# Altium project PCB_Middle.PrjPcb
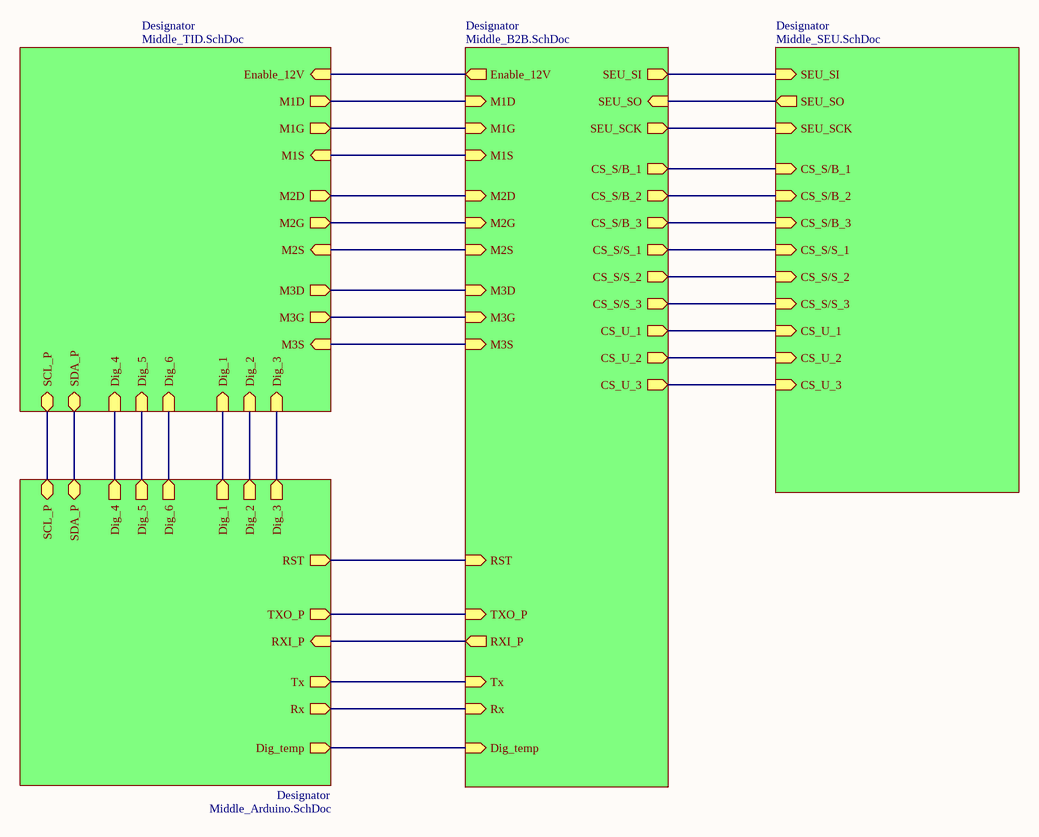
[diagram p0: Middle_Main.SchDoc]
5 sheets, 96 parts. Net scope: hierarchical (ports join the sheet entries above them; power ports are global).
Board file: Middle_PCB_PC104_Shield_Positioning.PcbDoc
Sheets:
  Middle_Main.SchDoc
    Designator = Middle_TID.SchDoc
      Designator = Middle_TID_B.SchDoc
    Designator = Middle_Arduino.SchDoc
    Designator = Middle_B2B.SchDoc

## Sheet Middle_Main.SchDoc
size A4

### Sub-sheets
Designator = Middle_TID.SchDoc: M1D (out), M1G (out), M1S (in), M2D (out), M2G (out), M2S (in), M3D (out), M3G (out), M3S (in), Dig_1 (in), Dig_2 (in), Dig_3 (in), SCL_P (bidir), SDA_P (bidir), Enable_12V (in), Dig_4 (in), Dig_5 (in), Dig_6 (in)
Designator = Middle_SEU.SchDoc (file not in this document): SEU_SI (in), SEU_SO (out), SEU_SCK (in), CS_S/B_2 (in), CS_S/B_3 (in), CS_S/S_1 (in), CS_S/S_2 (in), CS_S/S_3 (in), CS_U_1 (in), CS_U_2 (in), CS_S/B_1 (in), CS_U_3 (in)
Designator = Middle_Arduino.SchDoc: SCL_P (bidir), SDA_P (bidir), Dig_1 (out), Dig_2 (out), Dig_3 (out), TXO_P (out), RXI_P (in), Dig_5 (out), Dig_6 (out), Dig_4 (out), RST (out), Tx (out), Rx (out), Dig_temp (out)
Designator = Middle_B2B.SchDoc: M1D (in), M1G (in), M1S (in), M2D (in), M2G (in), M2S (in), M3D (in), M3G (in), M3S (in), SEU_SI (out), SEU_SO (in), SEU_SCK (out), CS_S/B_2 (out), CS_S/B_3 (out), CS_S/S_1 (out), CS_S/S_2 (out), CS_S/S_3 (out), CS_U_1 (out), CS_U_2 (out), CS_S/B_1 (out), CS_U_3 (out), TXO_P (in), RXI_P (out), Enable_12V (out), RST (in), Tx (in), Rx (in), Dig_temp (in)

### Nets
Dig_1: sheet Designator/Dig_1, sheet Designator/Dig_1
Dig_2: sheet Designator/Dig_2, sheet Designator/Dig_2
Dig_3: sheet Designator/Dig_3, sheet Designator/Dig_3
Dig_4: sheet Designator/Dig_4, sheet Designator/Dig_4
Dig_5: sheet Designator/Dig_5, sheet Designator/Dig_5
Dig_6: sheet Designator/Dig_6, sheet Designator/Dig_6
Dig_temp: sheet Designator/Dig_temp, sheet Designator/Dig_temp
M1D: sheet Designator/M1D, sheet Designator/M1D
M1G: sheet Designator/M1G, sheet Designator/M1G
M1S: sheet Designator/M1S, sheet Designator/M1S
M2D: sheet Designator/M2D, sheet Designator/M2D
M2G: sheet Designator/M2G, sheet Designator/M2G
M2S: sheet Designator/M2S, sheet Designator/M2S
M3D: sheet Designator/M3D, sheet Designator/M3D
M3G: sheet Designator/M3G, sheet Designator/M3G
M3S: sheet Designator/M3S, sheet Designator/M3S
PWR_CTRL_SS_12V: sheet Designator/Enable_12V, sheet Designator/Enable_12V
RST: sheet Designator/RST, sheet Designator/RST
Rx: sheet Designator/Rx, sheet Designator/Rx
SCL (AP): sheet Designator/SCL_P, sheet Designator/SCL_P
SDA (AP): sheet Designator/SDA_P, sheet Designator/SDA_P
SS_EXP1_CLK: sheet Designator/SEU_SCK, sheet Designator/SEU_SCK
SS_EXP1_CS_S/B_0: sheet Designator/CS_S/B_3, sheet Designator/CS_S/B_3
SS_EXP1_CS_S/B_1: sheet Designator/CS_S/B_1, sheet Designator/CS_S/B_1
SS_EXP1_CS_S/B_2: sheet Designator/CS_S/B_2, sheet Designator/CS_S/B_2
SS_EXP1_CS_S/S_0: sheet Designator/CS_S/S_3, sheet Designator/CS_S/S_3
SS_EXP1_CS_S/S_1: sheet Designator/CS_S/S_2, sheet Designator/CS_S/S_2
SS_EXP1_CS_S/S_2: sheet Designator/CS_S/S_1, sheet Designator/CS_S/S_1
SS_EXP1_CS_U_0: sheet Designator/CS_U_3, sheet Designator/CS_U_3
SS_EXP1_CS_U_1: sheet Designator/CS_U_1, sheet Designator/CS_U_1
SS_EXP1_CS_U_2: sheet Designator/CS_U_2, sheet Designator/CS_U_2
SS_EXP1_MISO: sheet Designator/SEU_SO, sheet Designator/SEU_SO
SS_EXP1_MOSI: sheet Designator/SEU_SI, sheet Designator/SEU_SI
SS_EXP2_RXI_P: sheet Designator/RXI_P, sheet Designator/RXI_P
SS_EXP2_TXO_P: sheet Designator/TXO_P, sheet Designator/TXO_P
Tx: sheet Designator/Tx, sheet Designator/Tx

## Sheet Middle_TID.SchDoc
size A4
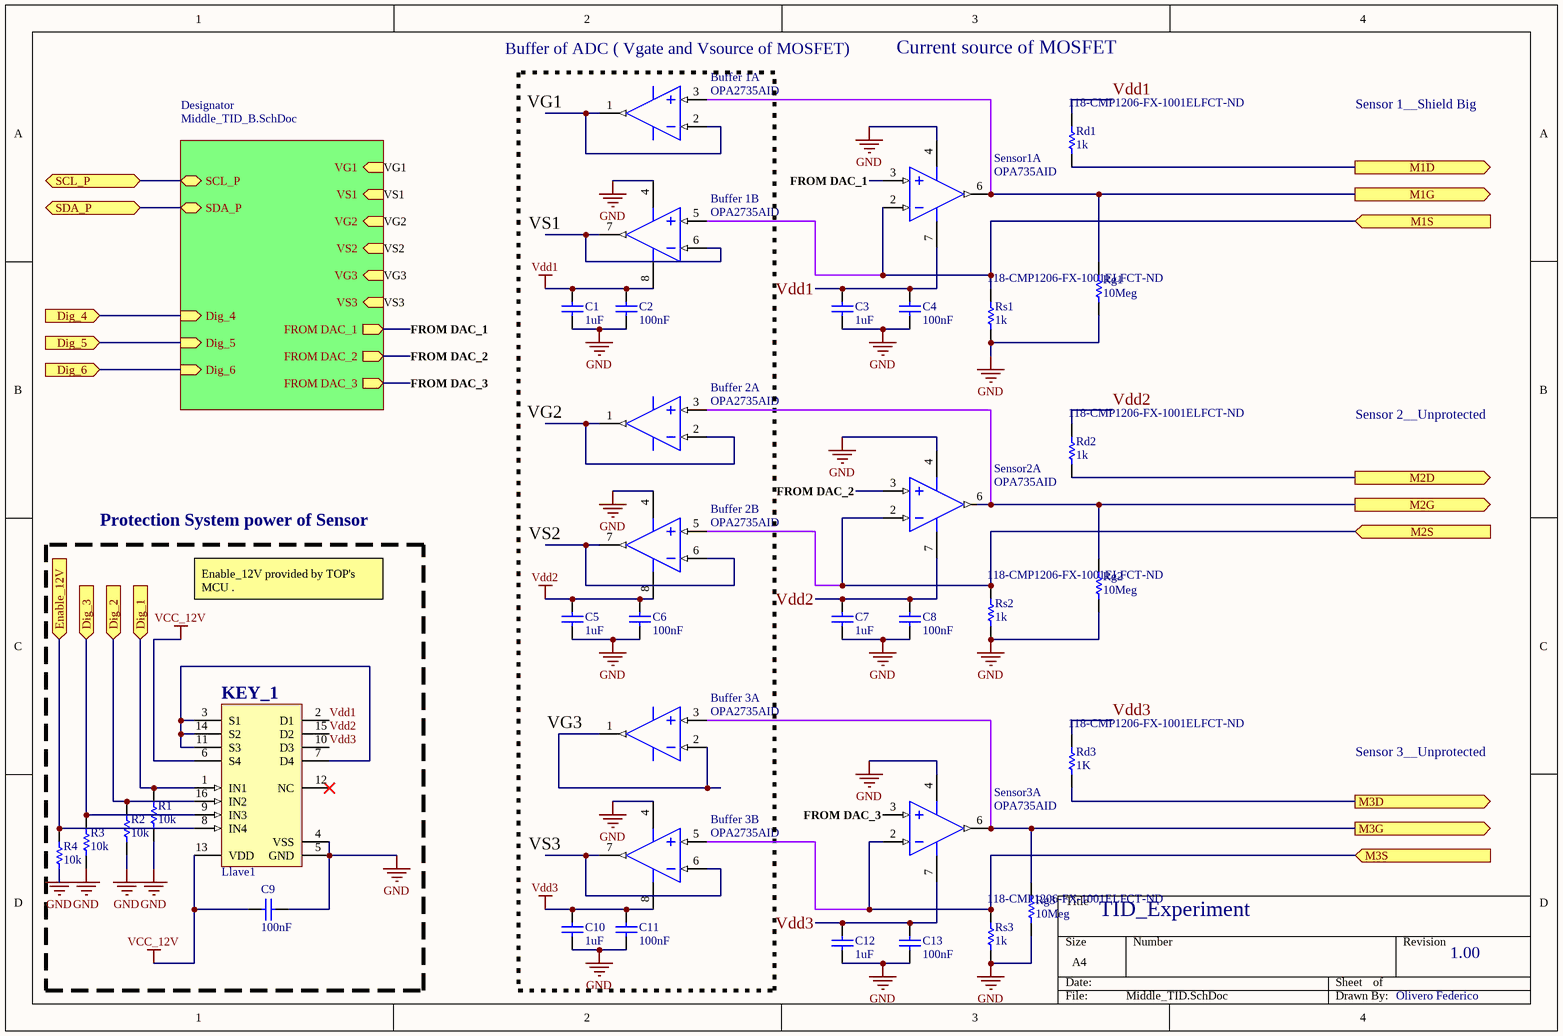
[diagram p1: Middle_TID.SchDoc]

### Parts
Buffer_1  OPA2735AID  [TI-D8_N]  (parts A,B of 2)
Buffer_2  OPA2735AID  [TI-D8_N]  (parts A,B of 2)
Buffer_3  OPA2735AID  [TI-D8_N]  (parts A,B of 2)
C1  1uF  [C1206]
C2  100nF  [C1206]
C3  1uF  [C1206]
C4  100nF  [C1206]
C5  1uF  [C1206]
C6  100nF  [C1206]
C7  1uF  [C1206]
C8  100nF  [C1206]
C9  100nF  [C1206]
C10  1uF  [C1206]
C11  100nF  [C1206]
C12  1uF  [C1206]
C13  100nF  [C1206]
KEY_1  Llave1  [ADI-RU-16_N]
R1  10k  [R1206]
R2  10k  [R1206]
R3  10k  [R1206]
R4  10k  [R1206]
Rd1  1k  Supplier Part Number 1: 118-CMP1206-FX-1001ELFCT-ND  [R1206]
Rd2  1k  Supplier Part Number 1: 118-CMP1206-FX-1001ELFCT-ND  [R1206]
Rd3  1K  Supplier Part Number 1: 118-CMP1206-FX-1001ELFCT-ND  [R1206]
Rg1  10Meg  [R1206]
Rg2  10Meg  [R1206]
Rg3  10Meg  [R1206]
Rs1  1k  Supplier Part Number 1: 118-CMP1206-FX-1001ELFCT-ND  [R1206]
Rs2  1k  Supplier Part Number 1: 118-CMP1206-FX-1001ELFCT-ND  [R1206]
Rs3  1k  Supplier Part Number 2: 118-CMP1206-FX-1001ELFCT-ND  [R1206]
Sensor1  OPA735AID  [TI-D8_N]  (part A of 2)
Sensor2  OPA735AID  [TI-D8_N]  (part A of 2)
Sensor3  OPA735AID  [TI-D8_N]  (part A of 2)

### Blocks framed on the sheet
Protection System power of Sensor: C9 KEY_1 R1-R4

### Sub-sheets
Designator = Middle_TID_B.SchDoc: VG1 (in), VS1 (in), VG2 (in), VS2 (in), VG3 (in), VS3 (in), SCL_P (bidir), SDA_P (bidir), FROM DAC_1 (out), Dig_4 (in), Dig_5 (in), Dig_6 (in), FROM DAC_2 (out), FROM DAC_3 (out)

### Ports
Dig_1 (in), Dig_2 (in), Dig_3 (in), Dig_4 (in), Dig_5 (in), Dig_6 (in), Enable_12V (in), M1D (out), M1G (out), M1S (in), M2D (out), M2G (out), M2S (in), M3D (out), M3G (out), M3S (in), SCL_P (bidir), SDA_P (bidir)

### Nets
GND: Buffer_1.4(V-) Buffer_2.4(V-) Buffer_3.4(V-) C1.1 C2.1 C3.1 C4.1 C5.1 C6.1 C7.1 C8.1 C9.1 C10.1 C11.1 C12.1 C13.1 KEY_1.4(VSS) KEY_1.5(GND) R1.1 R2.1 R3.1 R4.1 Rg1.1 Rg2.1 Rg3.1 Rs1.1 Rs2.1 Rs3.1 Sensor1.4(V-) Sensor2.4(V-) Sensor3.4(V-)
VCC_12V: C9.2 KEY_1.6(S4) KEY_1.13(VDD)
Vdd1: Buffer_1.8(V+) C1.2 C2.2 C3.2 C4.2 KEY_1.2(D1) Rd1.2 Sensor1.7(V+)
Vdd2: Buffer_2.8(V+) C5.2 C6.2 C7.2 C8.2 KEY_1.15(D2) Rd2.2 Sensor2.7(V+)
Vdd3: Buffer_3.8(V+) C10.2 C11.2 C12.2 C13.2 KEY_1.10(D3) Rd3.2 Sensor3.7(V+)
Dig_1: KEY_1.1(IN1) R1.2 ; port Dig_1
Dig_2: KEY_1.16(IN2) R2.2 ; port Dig_2
Dig_3: KEY_1.9(IN3) R3.2 ; port Dig_3
Dig_4: port Dig_4, sheet Designator/Dig_4
Dig_5: port Dig_5, sheet Designator/Dig_5
Dig_6: port Dig_6, sheet Designator/Dig_6
FROM DAC_1: Sensor1.3(IN+) ; sheet Designator/FROM DAC_1
FROM DAC_2: Sensor2.3(IN+) ; sheet Designator/FROM DAC_2
FROM DAC_3: Sensor3.3(IN+) ; sheet Designator/FROM DAC_3
M1D: Rd1.1 ; port M1D
M1G: Buffer_1.3(IN_A+) Rg1.2 Sensor1.6(OUT) ; port M1G
M1S: Buffer_1.5(IN_B+) Rs1.2 Sensor1.2(IN-) ; port M1S
M2D: Rd2.1 ; port M2D
M2G: Buffer_2.3(IN_A+) Rg2.2 Sensor2.6(OUT) ; port M2G
M2S: Buffer_2.5(IN_B+) Rs2.2 Sensor2.2(IN-) ; port M2S
M3D: Rd3.1 ; port M3D
M3G: Buffer_3.3(IN_A+) Rg3.2 Sensor3.6(OUT) ; port M3G
M3S: Buffer_3.5(IN_B+) Rs3.2 Sensor3.2(IN-) ; port M3S
PWR_CTRL_SS_12V: KEY_1.8(IN4) R4.2 ; port Enable_12V
SCL (AP): port SCL_P, sheet Designator/SCL_P
SDA (AP): port SDA_P, sheet Designator/SDA_P
VG1: Buffer_1.1(OUT_A) Buffer_1.2(IN_A-) ; sheet Designator/VG1
VG2: Buffer_2.1(OUT_A) Buffer_2.2(IN_A-) ; sheet Designator/VG2
VG3: Buffer_3.1(OUT_A) Buffer_3.2(IN_A-) ; sheet Designator/VG3
VS1: Buffer_1.6(IN_B-) Buffer_1.7(OUT_B) ; sheet Designator/VS1
VS2: Buffer_2.6(IN_B-) Buffer_2.7(OUT_B) ; sheet Designator/VS2
VS3: Buffer_3.6(IN_B-) Buffer_3.7(OUT_B) ; sheet Designator/VS3
NetKEY_1_3: KEY_1.3(S1) KEY_1.7(D4) KEY_1.11(S3) KEY_1.14(S2)

Not connected (* = marked no-connect by the designer): KEY_1 12(NC)*

### Notes on the sheet
- (near Buffer_1) Buffer of ADC ( Vgate and Vsource of MOSFET)
- Current source of MOSFET
- Sensor 1__Shield Big
- Sensor 2__Unprotected
- Enable_12V provided by TOP's MCU .
- Sensor 3__Unprotected
- TID_Experiment
- 1.00
- Olivero Federico

### Library data of the parts
Buffer_1-Buffer_3 = OPA2735AID: 0.05 uV/degC (max) Single-Supply CMOS Operational Amplifier, Zero-Drift Series, 2.7 to 12 V, -40 to 85 degC, 8-pin SOIC (D8), Green (RoHS & no Sb/Br); Manufacturer: Texas Instruments; CMRR(Min)(dB): 115; GBW(Typ)(MHz): 1.6; IIB(Max)(pA): 200; Iq per channel(Max)(mA): 0.75; Number of Channels: 2; Offset Drift(Typ)(uV/C): 0.01; Packing: TUBE; Rating: Catalog; Slew Rate(Typ)(V/us): 1.5; Sub Family: Low Offset Voltage Amplifier (<=500uV), Low Supply Voltage Amplifier (<=2.7V), Precision Amplifier, Zero Drift Precision Amplifier; Total Supply Voltage(Max)(+5V is 5, +/-5V is 10): 12; Total Supply Voltage(Min)(+5V is 5, +/-5V is 10): 2.7; Vio (25C)(Max)(mV): 0.005; DatasheetVersion: SBOS282B; PackageVersion: 4040047-3/M, 06/2011; PackageReference: D8; PackageDescription: 8-Pin Plastic Small Outline, Body 4.9 x 3.9 mm, Pitch 1.27 mm; Supplier 1: Digi-Key; Supplier Part Number 1: 296-16770-5-ND; Supplier 2: Newark; Supplier Part Number 2: 01J0602; Supplier 3: Mouser; Supplier Part Number 3: 595-OPA2735AID; Eco-Plan: Green (RoHS & no Sb/Br); Mounting Technology: Surface Mount; Code_JEDEC: MS-012; PartNumber: OPA2735AID; ComponentLink1Description: Manufacturer URL; ComponentLink1URL: http://www.ti.com/; ComponentLink2Description: Datasheet; ComponentLink2URL: http://www.ti.com/lit/ds/symlink/opa2735.pdf; ComponentLink3Description: Package Specification; ComponentLink3URL: http://www.ti.com/litv/pdf/msoi002j
C1-C13 = C1206: 1206 Capacitor
  C1 C3 C5 C7 C10: Supplier 1: Digi-Key; Supplier Part Number 1: 399-1255-1-ND
  C2 C4 C6 C8 C9 C11 C13: Supplier 1: Digi-Key; Supplier Part Number 1: 478-1556-1-ND
KEY_1 = ADG5412BRUZ: High Voltage Latch-Up Proof, Quad SPST Switches, -40 to 125 degC, 16-pin SOP (RU-16), Tube; Manufacturer: Analog Devices; Id, Is (ON): 100pA, 100pA, 100pA, 100pA; Is OFF: 50pA, 50pA, 50pA, 50pA; Power Dissipation: 1mW; Ron (ohms): 9; DatasheetVersion: Rev. A; PackageVersion: Nov-02; PackageReference: RU-16; PackageDescription: 16-Pin Thin Shrink Small Outline Package, Body 5 x 4.4 mm, Pitch 0.65 mm; Supplier 1: Digi-Key; Supplier Part Number 1: ADG5412BRUZ-ND; Supplier 2: Farnell; Supplier Part Number 2: 2081057; Supplier 3: Newark; Supplier Part Number 3: 85R6320; Supplier 4: Mouser; Supplier Part Number 4: 584-ADG5412BRUZ; Configuration: SPST; Packing: Tube; Mounting Technology: Surface Mount; Code_JEDEC: MO-153AB; PartNumber: ADG5412BRUZ; ComponentLink1Description: Manufacturer URL; ComponentLink1URL: http://www.analog.com/en/index.html; ComponentLink2Description: Datasheet; ComponentLink2URL: http://www.analog.com/static/imported-files/data_sheets/ADG5412_5413.pdf; ComponentLink3Description: Package Specification; ComponentLink3URL: http:/www.analog.com/static/imported-files/packages/36244347913743854010197452789RU16.pdf
R1-R4 = R1206: 1206 Resistor; Value: *; Supplier 1: Digi-Key; Supplier Part Number 1: 541-CRCW120610K0JNTACT-ND
Rd1-Rd3 Rg1-Rg3 Rs1-Rs3 = R1206: 1206 Resistor  1% CMP2010A 1Watt 100ppm; Value: *
  Rd1-Rd3 Rs1 Rs2: Supplier 1: Digi-Key
  Rg1: Supplier 1: DigiKey; Supplier Part Number 1: 541-CRCW120610M0FKEBCT-ND; Supplier 2: Digi-Key; Supplier Part Number 2: 541-10MECT-ND
  Rg2 Rg3: Supplier 1: Digi-Key; Supplier Part Number 1: 541-10MECT-ND
  Rs3: Supplier 1: Digi-Key; Supplier Part Number 1: 118-CMP2010AFX-1001ELFCT-ND; Supplier 2: Digi-Key
Sensor1-Sensor3 = OPA735AID: 0.05 uV/degC (Max), Single-Supply CMOS Zero-Drift Series Operational Amplifier, 2.7 to 12 V, -40 to 85 degC, 8-pin SOIC (D8), Green (RoHS & no Sb/Br); Manufacturer: Texas Instruments; CMRR(Min)(dB): 115; GBW(Typ)(MHz): 1.6; IIB(Max)(pA): 200; Iq per channel(Max)(mA): 0.75; Number of Channels: 1; Offset Drift(Typ)(uV/C): 0.01; Packing: TUBE; Rating: Catalog; Slew Rate(Typ)(V/us): 1.5; Sub Family: Low Offset Voltage Amplifier (<=500uV), Low Supply Voltage Amplifier (<=2.7V), Precision Amplifier, Zero Drift Precision Amplifier; Total Supply Voltage(Max)(+5V is 5, +/-5V is 10): 12; Total Supply Voltage(Min)(+5V is 5, +/-5V is 10): 2.7; Vio (25C)(Max)(mV): 0.005; DatasheetVersion: SBOS282B; PackageVersion: 4040047-3/M, 06/2011; PackageReference: D8; PackageDescription: 8-Pin Plastic Small Outline, Body 4.9 x 3.9 mm, Pitch 1.27 mm; Supplier 1: Digi-Key; Supplier Part Number 1: 296-17995-ND; Supplier 2: Farnell; Supplier Part Number 2: 1212328; Supplier 3: Newark; Supplier Part Number 3: 90H2263; Supplier 4: Mouser; Supplier Part Number 4: 595-OPA735AID; Eco-Plan: Green (RoHS & no Sb/Br); Mounting Technology: Surface Mount; Code_JEDEC: MS-012; PartNumber: OPA735AID; ComponentLink1Description: Manufacturer URL; ComponentLink1URL: http://www.ti.com/; ComponentLink2Description: Datasheet; ComponentLink2URL: http://www.ti.com/lit/ds/symlink/opa735.pdf; ComponentLink3Description: Package Specification; ComponentLink3URL: http://www.ti.com/litv/pdf/msoi002j

## Sheet Middle_TID_B.SchDoc
size A4
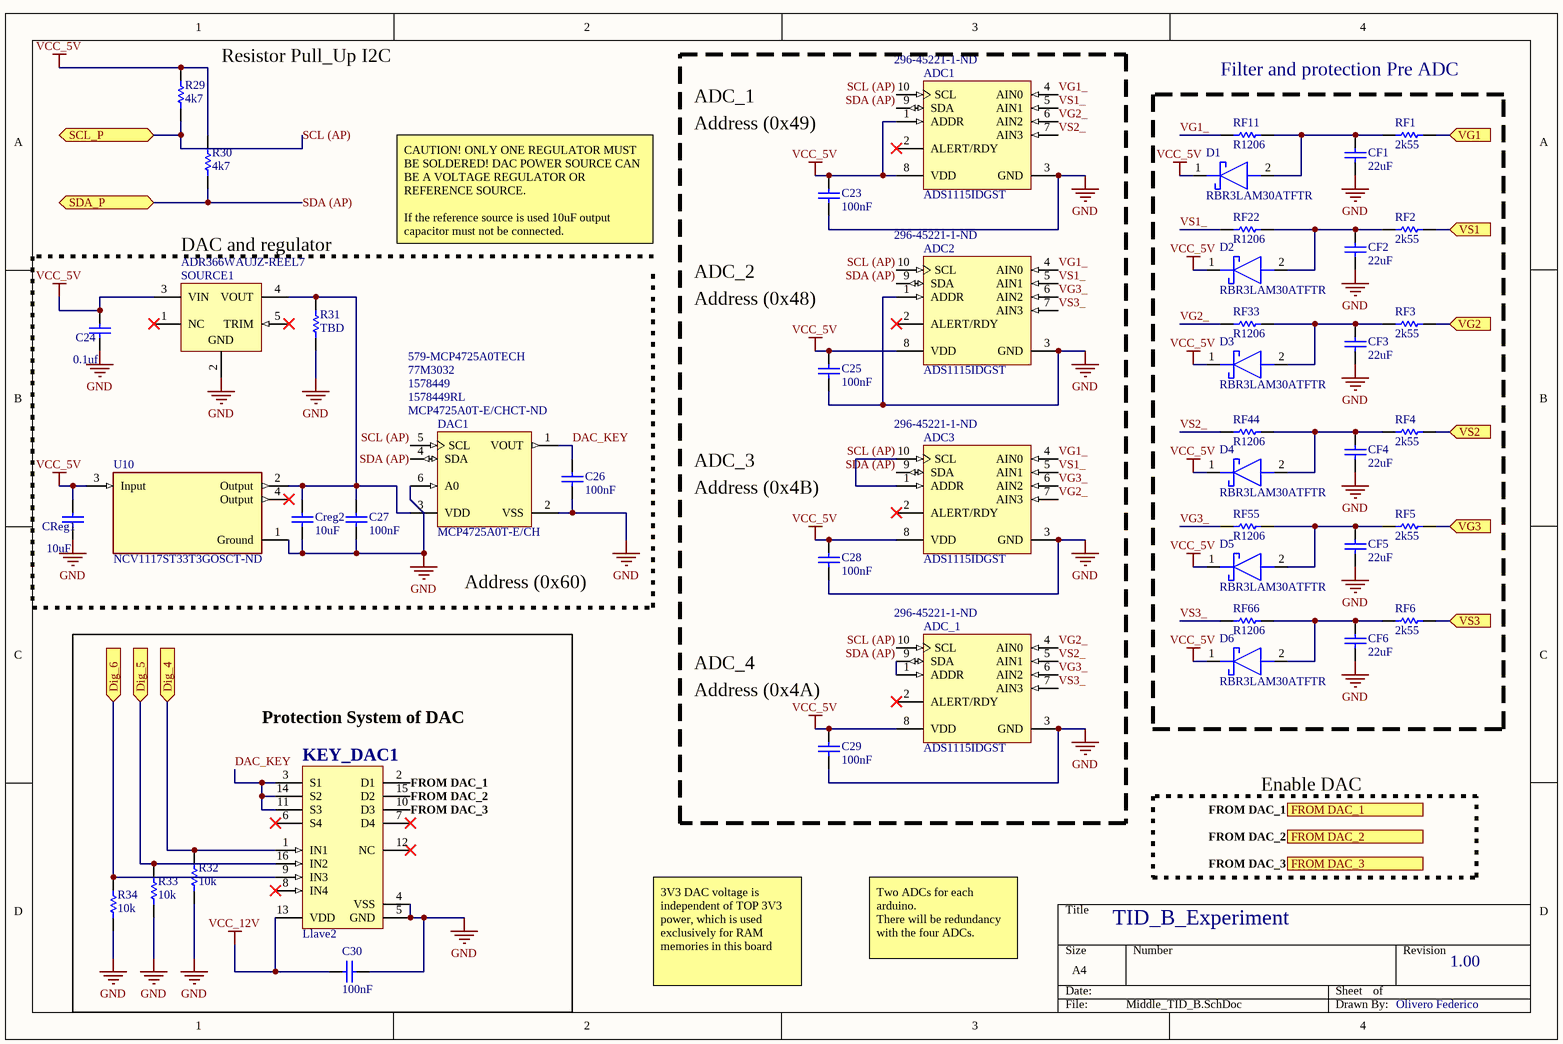
[diagram p2: Middle_TID_B.SchDoc]

### Parts
ADC1  ADS1115IDGST  Supplier Part Number 1: 296-45221-1-ND  [TI-DGS10_N]
ADC2  ADS1115IDGST  Supplier Part Number 1: 296-45221-1-ND  [TI-DGS10_N]
ADC3  ADS1115IDGST  Supplier Part Number 1: 296-45221-1-ND  [TI-DGS10_N]
ADC_1  ADS1115IDGST  Supplier Part Number 1: 296-45221-1-ND  [TI-DGS10_N]
C23  100nF  [C1206]
C24  0.1uf  [C1206]
C25  100nF  [C1206]
C26  100nF  [C1206]
C27  100nF  [C1206]
C28  100nF  [C1206]
C29  100nF  [C1206]
C30  100nF  [C1206]
CF1  22uF  [C1206]
CF2  22uF  [C1206]
CF3  22uF  [C1206]
CF4  22uF  [C1206]
CF5  22uF  [C1206]
CF6  22uF  [C1206]
CReg1  10uF  [C1206]
Creg2  10uF  [C1206]
D1  RBR3LAM30ATFTR  [SODFL4725X105N]
D2  RBR3LAM30ATFTR  [SODFL4725X105N]
D3  RBR3LAM30ATFTR  [SODFL4725X105N]
D4  RBR3LAM30ATFTR  [SODFL4725X105N]
D5  RBR3LAM30ATFTR  [SODFL4725X105N]
D6  RBR3LAM30ATFTR  [SODFL4725X105N]
DAC1  MCP4725A0T-E/CH  Supplier Part Number 1: MCP4725A0T-E/CHCT-ND  Supplier Part Number 2: 1578449RL  Supplier Part Number 3: 1578449  Supplier Part Number 4: 77M3032  Supplier Part Number 5: 579-MCP4725A0TECH  [SOT-23-CH6_N]
KEY_DAC1  Llave2  [ADI-RU-16_N]
R29  4k7  [R1206]
R30  4k7  [R1206]
R31  TBD  [R1206]
R32  10k  [R1206]
R33  10k  [R1206]
R34  10k  [R1206]
RF1  2k55  [R1206]
RF2  2k55  [R1206]
RF3  2k55  [R1206]
RF4  2k55  [R1206]
RF5  2k55  [R1206]
RF6  2k55  [R1206]
RF11  R1206  [R1206]
RF22  R1206  [R1206]
RF33  R1206  [R1206]
RF44  R1206  [R1206]
RF55  R1206  [R1206]
RF66  R1206  [R1206]
SOURCE1  ADR366WAUJZ-REEL7  [ADI-UJ-5_M]
U10  NCV1117ST33T3GOSCT-ND  [FP-318H-MFG]

### Blocks framed on the sheet
Filter and protection Pre ADC: CF1-CF6 D1-D6 RF1-RF6 RF11 RF22 RF33 RF44 RF55 RF66

### Ports
Dig_4 (in), Dig_5 (in), Dig_6 (in), FROM DAC_1 (out), FROM DAC_2 (out), FROM DAC_3 (out), SCL_P (bidir), SDA_P (bidir), VG1 (in), VG2 (in), VG3 (in), VS1 (in), VS2 (in), VS3 (in)

### Nets
GND: ADC1.3(GND) ADC2.1(ADDR) ADC2.3(GND) ADC3.3(GND) ADC_1.3(GND) C23.1 C24.2 C25.1 C26.1 C27.1 C28.1 C29.1 C30.1 CF1.1 CF2.1 CF3.1 CF4.1 CF5.1 CF6.1 CReg1.2 Creg2.1 DAC1.2(VSS) DAC1.6(A0) KEY_DAC1.4(VSS) KEY_DAC1.5(GND) R31.1 R32.1 R33.1 R34.1 SOURCE1.2(GND) U10.1(Ground)
VCC_5V: ADC1.1(ADDR) ADC1.8(VDD) ADC2.8(VDD) ADC3.8(VDD) ADC_1.8(VDD) C23.2 C24.1 C25.2 C28.2 C29.2 CReg1.1 D1.1(K) D2.1(K) D3.1(K) D4.1(K) D5.1(K) D6.1(K) R29.2 R30.2 SOURCE1.3(VIN) U10.3(Input)
VCC_12V: C30.2 KEY_DAC1.13(VDD)
DAC_KEY: C26.2 DAC1.1(VOUT) KEY_DAC1.3(S1) KEY_DAC1.11(S3) KEY_DAC1.14(S2)
Dig_4: KEY_DAC1.1(IN1) R32.2 ; port Dig_4
Dig_5: KEY_DAC1.16(IN2) R33.2 ; port Dig_5
Dig_6: KEY_DAC1.9(IN3) R34.2 ; port Dig_6
FROM DAC_1: KEY_DAC1.2(D1) ; port FROM DAC_1
FROM DAC_2: KEY_DAC1.15(D2) ; port FROM DAC_2
FROM DAC_3: KEY_DAC1.10(D3) ; port FROM DAC_3
SCL (AP): ADC1.10(SCL) ADC2.10(SCL) ADC3.1(ADDR) ADC3.10(SCL) ADC_1.10(SCL) DAC1.5(SCL) R29.1 ; port SCL_P
SDA (AP): ADC1.9(SDA) ADC2.9(SDA) ADC3.9(SDA) ADC_1.1(ADDR) ADC_1.9(SDA) DAC1.4(SDA) R30.1 ; port SDA_P
VG1: RF1.2 ; port VG1
VG1_: ADC1.4(AIN0) ADC2.4(AIN0) ADC3.4(AIN0) RF11.1
VG2: RF3.2 ; port VG2
VG2_: ADC1.6(AIN2) ADC3.7(AIN3) ADC_1.4(AIN0) RF33.1
VG3: RF5.2 ; port VG3
VG3_: ADC2.6(AIN2) ADC3.6(AIN2) ADC_1.6(AIN2) RF55.1
VS1: RF2.2 ; port VS1
VS1_: ADC1.5(AIN1) ADC2.5(AIN1) ADC3.5(AIN1) RF22.1
VS2: RF4.2 ; port VS2
VS2_: ADC1.7(AIN3) ADC_1.5(AIN1) RF44.1
VS3: RF6.2 ; port VS3
VS3_: ADC2.7(AIN3) ADC_1.7(AIN3) RF66.1
NetC27_2: C27.2 Creg2.2 DAC1.3(VDD) R31.2 SOURCE1.4(VOUT) U10.2(Output)
NetCF1_2: CF1.2 D1.2(A) RF1.1 RF11.2
NetCF2_2: CF2.2 D2.2(A) RF2.1 RF22.2
NetCF3_2: CF3.2 D3.2(A) RF3.1 RF33.2
NetCF4_2: CF4.2 D4.2(A) RF4.1 RF44.2
NetCF5_2: CF5.2 D5.2(A) RF5.1 RF55.2
NetCF6_2: CF6.2 D6.2(A) RF6.1 RF66.2

Not connected (* = marked no-connect by the designer): ADC1 2(ALERT/RDY)*; ADC2 2(ALERT/RDY)*; ADC3 2(ALERT/RDY)*; ADC_1 2(ALERT/RDY)*; KEY_DAC1 6(S4)* 7(D4)* 8(IN4)* 12(NC)*; SOURCE1 1(NC)* 5(TRIM)*; U10 4(Output)*

### Notes on the sheet
- (near R29) Resistor Pull_Up I2C
- ADC_1
- Address (0x49)
- DAC and regulator
- CAUTION! ONLY ONE REGULATOR MUST BE SOLDERED! DAC POWER SOURCE CAN BE A VOLTAGE REGULATOR OR REFERENCE SOURCE.
  If the reference source is used 10uF output capacitor must not be connected.
- Address (0x48)
- ADC_2
- Address (0x4B)
- ADC_3
- Address (0x60)
- Protection System of DAC
- (near C29) Address (0x4A)
- ADC_4
- Enable DAC
- TID_B_Experiment
- 3V3 DAC voltage is independent of TOP 3V3 power, which is used exclusively for RAM memories in this board
- Two ADCs for each arduino.
  There will be redundancy with the four ADCs.
- 1.00
- Olivero Federico

### Library data of the parts
ADC1-ADC3 ADC_1 = ADS1115IDGST: 16-Bit ADC with Integrated Multiplexer, PGA, Comparator, Oscillator, and Reference, -40 to 125 degC, 10-pin SOP (DGS10), Green (RoHS & no Sb/Br); Manufacturer: Texas Instruments; # Input Channels: 4; Analog Voltage AV/DD(Max)(V): 5.5; Analog Voltage AV/DD(Min)(V): 2; Architecture: Delta-Sigma; INL(Max)(+/-LSB): 1; Interface: Serial I2C; Resolution(Bits): 16; Sample Rate (max)(SPS): 860; SubFamily: Precision ADC (<=10MSPS); DatasheetVersion: SBAS444B; PackageVersion: 4073272/C, 02/2004; PackageReference: DGS10; PackageDescription: 10-Pin Plastic Small Outline, Body 3 x 3 mm, Pitch 0.5 mm; Digital Supply(Max)(V): 5.5; Digital Supply(Min)(V): 2; Eco-Plan: Green (RoHS & no Sb/Br); Mounting Technology: Surface Mount; Code_JEDEC: MO-153; PartNumber: ADS1115IDGST; ComponentLink1Description: Manufacturer URL; ComponentLink1URL: http://www.ti.com/; ComponentLink2Description: Datasheet; ComponentLink2URL: http://www.ti.com/general/docs/lit/getliterature.tsp?genericPartNumber=ADS1115&fileType=pdf; ComponentLink3Description: Package Specification; ComponentLink3URL: http://www.ti.com/lit/ml/mpds035b/mpds035b.pdf; Supplier 1: Digi-Key
C23-C30 CF1-CF6 CReg1 Creg2 = C1206: 1206 Capacitor; Supplier 1: Digi-Key
  C23-C30: Supplier Part Number 1: 478-1556-1-ND
  CF1-CF6: Supplier Part Number 1: 490-4843-1-ND
  CReg1 Creg2: Supplier Part Number 1: 478-3811-1-ND
D1-D6 = RBR3LAM30ATFTR: Schottky Diode; Manufacturer_Name: ROHM Semiconductor; Datasheet Link: https://componentsearchengine.com/Datasheets/2/RBR3LAM30ATFTR.pdf; Height: 1.05mm; Manufacturer_Part_Number: RBR3LAM30ATFTR; Mouser Part Number: 755-RBR3LAM30ATFTR; Mouser Price/Stock: https://www.mouser.co.uk/ProductDetail/ROHM-Semiconductor/RBR3LAM30ATFTR?qs=4v%252BiZTmLVHGRR7OWAomL%252Bg%3D%3D
DAC1 = MCP4725A0T-E/CH: 12-Bit Digital-to-Analog Converter with EEPROM Memory in SOT-23-6, 6-Pin SOT-23, Extended Temperature, Tape and Reel; Manufacturer: Microchip; DatasheetVersion: revD, Jun-2009; PackageVersion: revBB, Aug-2009; PackageReference: SOT-23-CH6; PackageDescription: 6-Lead Plastic Small Outline Transistor (CH) [SOT-23]; Mounting Technology: Surface Mount; Code_IPC: SOT26A-6; PartNumber: MCP4725A0T-E/CH; ComponentLink1Description: Manufacturer URL; ComponentLink1URL: http://www.microchip.com/; ComponentLink2Description: Datasheet; ComponentLink2URL: http://ww1.microchip.com/downloads/en/DeviceDoc/22039d.pdf; ComponentLink3Description: Package Specification; ComponentLink3URL: http://www.microchip.com/stellent/groups/techpub_sg/documents/packagingspec/en012702.pdf; Supplier 1: Digi-Key; Supplier 2: Farnell; Supplier 3: Farnell; Supplier 4: Newark; Supplier 5: Mouser
KEY_DAC1 = ADG5412BRUZ: as KEY_1 on sheet Middle_TID; DatasheetVersion: Rev. A; PackageVersion: Nov-02; PackageReference: RU-16; PackageDescription: 16-Pin Thin Shrink Small Outline Package, Body 5 x 4.4 mm, Pitch 0.65 mm; Supplier 1: Digi-Key; Supplier Part Number 1: ADG5412BRUZ-ND; Supplier 2: Farnell; Supplier Part Number 2: 2081057; Supplier 3: Newark; Supplier Part Number 3: 85R6320; Supplier 4: Mouser; Supplier Part Number 4: 584-ADG5412BRUZ; Configuration: SPST; Packing: Tube; Mounting Technology: Surface Mount; Code_JEDEC: MO-153AB; PartNumber: ADG5412BRUZ; ComponentLink1Description: Manufacturer URL; ComponentLink1URL: http://www.analog.com/en/index.html; ComponentLink2Description: Datasheet; ComponentLink2URL: http://www.analog.com/static/imported-files/data_sheets/ADG5412_5413.pdf; ComponentLink3Description: Package Specification; ComponentLink3URL: http:/www.analog.com/static/imported-files/packages/36244347913743854010197452789RU16.pdf
R29-R34 RF1-RF6 RF11 RF22 RF33 RF44 RF55 RF66 = R1206: 1206 Resistor; Value: *
  R29 R30: Supplier 1: Digi-Key; Supplier Part Number 1: 541-4.7KECT-ND
  R32-R34: Supplier 1: Digi-Key; Supplier Part Number 1: 541-CRCW120610K0JNTACT-ND
  RF1-RF6: Supplier 1: Digi-Key; Supplier Part Number 1: 541-2.55KFCT-ND
SOURCE1 = CMP-0784-00514-1: Low Power, Low Noise Voltage Reference with Sink / Source Capability, 3.3 V Output, 3.6 to 15 V Supply, Automotive, 5-pin SOT23 (UJ-5), Reel; Manufacturer: Analog Devices; Max V Supply (V): 15; Vout: 3.3V; Automotive Qualified: Yes; Min V Supply (V): 3.6; Ref Out TC (ppm/C): 25; ComponentLink1URL: http://www.analog.com/en/index.html; ComponentLink4URL: Product URL:http://www.analog.com/en/special-linear-functions/voltage-references/adr366/products/product.html; ComponentLink1Description: Manufacturer URL; Operating Temp Range: -40 to 125 degC; ComponentLink4Description: URL Link1; DatasheetVersion: Rev. D; PackageReference: UJ-5; PackageDescription: 5-Pin Thin Small Outline Transistor Package, Body 2.9 x 1.6 mm, Pitch 0.95 mm; PartNumber: ADR366WAUJZ-REEL7; Mounting Technology: Surface Mount; Code_JEDEC: MO-193-AB; ComponentLink2Description: Datasheet; ComponentLink3Description: Package Specification; Packing: Reel; ComponentLink2URL: http://www.analog.com/static/imported-files/data_sheets/ADR360_361_363_364_365_366.pdf; ComponentLink3URL: http:/www.analog.com/static/imported-files/packages/PKG_PDF/TSOT(UJ)/UJ_5.pdf; PackageVersion: 100708-A, 10/2008; Supplier 1: Digi-Key
U10 = CMP-07128-000021-1: IC REG LINEAR 3.3V 1A SOT223; Manufacturer: ON Semiconductor; Nominal Supply Current: 6mA; Min Supply Voltage: 2.4V; Number Of Outputs: 1; Standoff Height: 0.02mm; Automotive Grade: Grade 0; Accuracy Percentage: 1%; Max Junction Temp: +150°C; Output Type: Fixed; Dropout Voltage: 1.07V; Max Supply Voltage: 20V; Polarity: Positive; Quiescent Current: 10mA; Package: 318H; ComponentLink2Description: Datasheet; Output Current: 1A; Device Class L1: Integrated Circuits (ICs); Ambient Temperature Range Low: -40°C; Output Voltage: 3.3V; Octopart: https://octopart.com/ncv1117st33t3g-on+semiconductor-1215835; Manufacturer Part Number: NCV1117ST33T3G; Device Class L2: Power Management ICs; ComponentLink2URL: https://www.onsemi.com/pub/Collateral/NCP1117-D.PDF; Ipc Land Pattern Name: SOT230P700X180-4; Digikey Description: IC REG LINEAR 3.3V 1A SOT223; Height: 1.8mm; Ambient Temperature Range High: +125°C; Mouser Description: LDO Voltage Regulators 3.3V 1.0A Automotive; Category: IC; Temperature: -55°C to +150°C; Automotive: Yes; Temperature Range Low: -55°C; Temperature Range High: +150°C; Lead Free: Yes; Device Class L3: Voltage Regulators - Linear; RoHS: TRUE; ComponentLink3Description: New link; ComponentLink3URL: *; Supplier 1: Digi-Key; Supplier 2: Digi-Key; Stock 2: 7309; Pricing 2: 1=0,67000, 10=0,57500, 25=0,53640, 100=0,39850, 250=0,33720, 500=0,32188, 1000=0,23758 (USD); Mount: Surface Mount; Case/Package: SOT-223; Number of Pins: 3; Contact Plating: Tin,Matte; Min Operating Temperature: -40°C; Max Operating Temperature: 125°C; Package Quantity: 1; Packaging: Tape and Reel; Max Input Voltage: 20V; Number of Regulators: 1; Min Current Limit: 1A; Input Bias Current: 6mA; Max Output Current: 1A; Nominal Output Voltage: 3.3V; Accuracy: 1%; Output Voltage Accuracy: 1%; Series: Automotive, AEC-Q100; Length: 6.7mm; Width: 3.7mm; Radiation Hardening: No; REACH SVHC: No SVHC; RoHS Compliant: Yes; ComponentLink1URL: https://datasheet.ciiva.com/2061/ncp1117-d-2061392.pdf?src-supplier=Digi-Key; ComponentLink1Description: https://datasheet.ciiva.com/2061/ncp1117-d-2061392.pdf?src-supplier=Digi-Key; ComponentLink4URL: https://datasheet.ciiva.com/2061/ncp1117-d-2061390.pdf?src-supplier=Digi-Key; ComponentLink4Description: https://datasheet.ciiva.com/2061/ncp1117-d-2061390.pdf?src-supplier=Digi-Key; ComponentLink5URL: https://datasheet.ciiva.com/2061/ncp1117-d-2061391.pdf?src-supplier=Digi-Key; ComponentLink5Description: https://datasheet.ciiva.com/2061/ncp1117-d-2061391.pdf?src-supplier=Digi-Key; Supplier 3: Digi-Key

## Sheet Middle_Arduino.SchDoc
size A4
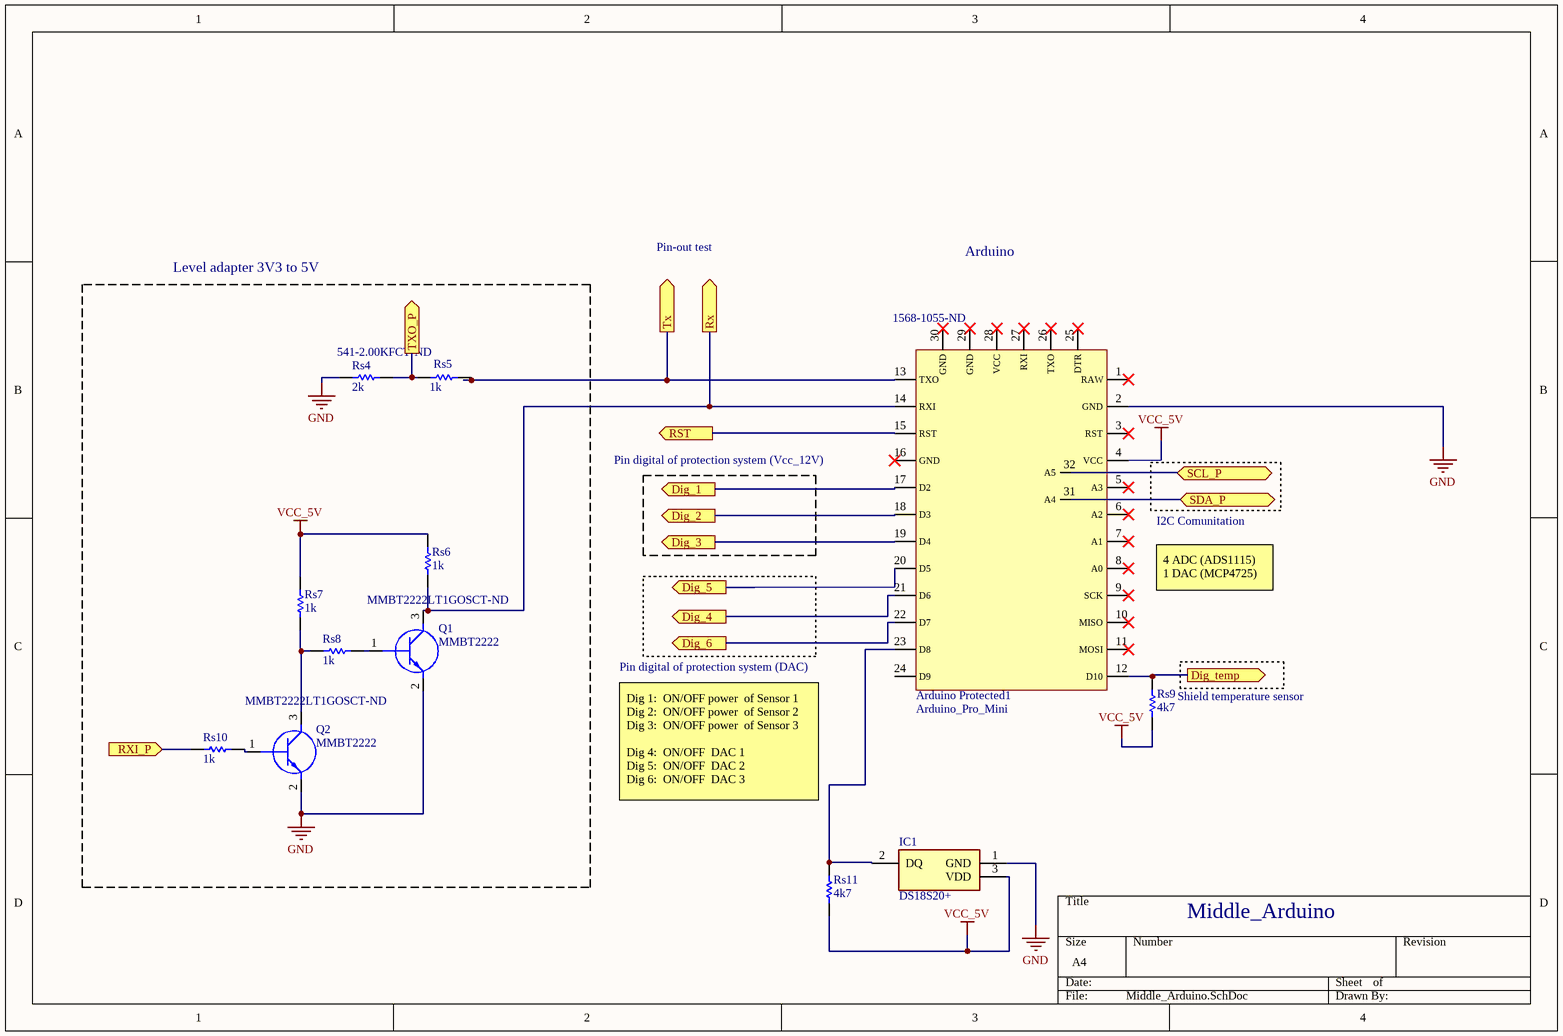
[diagram p3: Middle_Arduino.SchDoc]

### Parts
Arduino_Protected1  Arduino_Pro_Mini  Supplier Part Number 1: 1568-1055-ND  [Arduino_Pro_Mini]
IC1  DS18S20+  [ONSC-TO-92-3-29-11_AM_BL]
Q1  MMBT2222  Supplier Part Number 1: MMBT2222LT1GOSCT-ND  [SOT95P240X114-3N]
Q2  MMBT2222  Supplier Part Number 1: MMBT2222LT1GOSCT-ND  [SOT95P240X114-3N]
Rs4  2k  Supplier Part Number 1: 541-2.00KFCT-ND  [R1206]
Rs5  1k  [R1206]
Rs6  1k  [R1206]
Rs7  1k  [R1206]
Rs8  1k  [R1206]
Rs9  4k7  [R1206]
Rs10  1k  [R1206]
Rs11  4k7  [R1206]

### Blocks framed on the sheet
Level adapter 3V3 to 5V: Q1 Q2 Rs4-Rs8 Rs10

### Ports
Dig_1 (out), Dig_2 (out), Dig_3 (out), Dig_4 (out), Dig_5 (out), Dig_6 (out), Dig_temp (out), RST (out), Rx (out), RXI_P (in), SCL_P (bidir), SDA_P (bidir), Tx (out), TXO_P (out)

### Nets
GND: Arduino_Protected1.2(GND) IC1.1(GND) Q1.2(E) Q2.2(E) Rs4.1
VCC_5V: Arduino_Protected1.4(VCC) IC1.3(VDD) Rs6.2 Rs7.2 Rs9.1 Rs11.1
Dig_1: Arduino_Protected1.17(D2) ; port Dig_1
Dig_2: Arduino_Protected1.18(D3) ; port Dig_2
Dig_3: Arduino_Protected1.19(D4) ; port Dig_3
Dig_4: Arduino_Protected1.21(D6) ; port Dig_4
Dig_5: Arduino_Protected1.20(D5) ; port Dig_5
Dig_6: Arduino_Protected1.22(D7) ; port Dig_6
Dig_temp: Arduino_Protected1.12(D10) Rs9.2 ; port Dig_temp
RST: Arduino_Protected1.15(RST) ; port RST
Rx: Arduino_Protected1.14(RXI) Q1.3(C) Rs6.1 ; port Rx
SCL (AP): Arduino_Protected1.32(A5) ; port SCL_P
SDA (AP): Arduino_Protected1.31(A4) ; port SDA_P
SS_EXP2_RXI_P: Rs10.1 ; port RXI_P
SS_EXP2_TXO_P: Rs4.2 Rs5.1 ; port TXO_P
Tx: Arduino_Protected1.13(TXO) Rs5.2 ; port Tx
NetArduino_Protected1_23: Arduino_Protected1.23(D8) IC1.2(DQ) Rs11.2
NetQ1_1: Q1.1(B) Rs8.1
NetQ2_1: Q2.1(B) Rs10.2
NetQ2_3: Q2.3(C) Rs7.1 Rs8.2

Not connected (* = marked no-connect by the designer): Arduino_Protected1 1(RAW)* 3(RST)* 5(A3)* 6(A2)* 7(A1)* 8(A0)* 9(SCK)* 10(MISO)* 11(MOSI)* 16(GND)* 24(D9) 25(DTR)* 26(TXO)* 27(RXI)* 28(VCC)* 29(GND)* 30(GND)*

### Notes on the sheet
- Pin-out test
- Arduino
- (near Arduino_Protected1) Pin digital of protection system (Vcc_12V)
- (near Arduino_Protected1) I2C Comunitation
- (near Arduino_Protected1) 4 ADC (ADS1115)
  1 DAC (MCP4725)
- Pin digital of protection system (DAC)
- (near Rs9) Shield temperature sensor
- Dig 1:  ON/OFF power  of Sensor 1
  Dig 2:  ON/OFF power  of Sensor 2
  Dig 3:  ON/OFF power  of Sensor 3
  Dig 4:  ON/OFF  DAC 1
  Dig 5:  ON/OFF  DAC 2
  Dig 6:  ON/OFF  DAC 3
- Middle_Arduino

### Library data of the parts
IC1 = DS18S20+: Integrated Circuit; Manufacturer_Name: Maxim Integrated; Datasheet Link: https://datasheets.maximintegrated.com/en/ds/DS18S20.pdf; Height: 4.95mm; Manufacturer_Part_Number: DS18S20+; Mouser Part Number: 700-DS18S20; Mouser Price/Stock: https://www.mouser.co.uk/ProductDetail/Maxim-Integrated/DS18S20%2b?qs=0Y9aZN%252BMVCVr8Q2h8Exw2w%3D%3D
Q1 Q2 = MMBT2222: Transistor BJT NPN; Manufacturer_Name: ON Semiconductor; Datasheet Link: https://componentsearchengine.com/Datasheets/1/MMBT2222.pdf; Height: 1.14mm; Manufacturer_Part_Number: MMBT2222; Mouser Part Number: 512-MMBT2222; Mouser Price/Stock: https://www.mouser.co.uk/ProductDetail/ON-Semiconductor-Fairchild/MMBT2222/?qs=UMEuL5FsraD0NR7loUMuuw%3D%3D; Supplier 1: Digi-Key
Rs4-Rs11 = R1206: 1206 Resistor  1% CMP2010A 1Watt 100ppm; Value: *; Supplier 1: Digi-Key
  Rs5-Rs11: Supplier Part Number 1: 541-CRCW12061K00FKEBCT-ND
Arduino_Protected1 = Arduino_Pro_Mini: Supplier 1: Digi-Key

## Sheet Middle_B2B.SchDoc
size A4
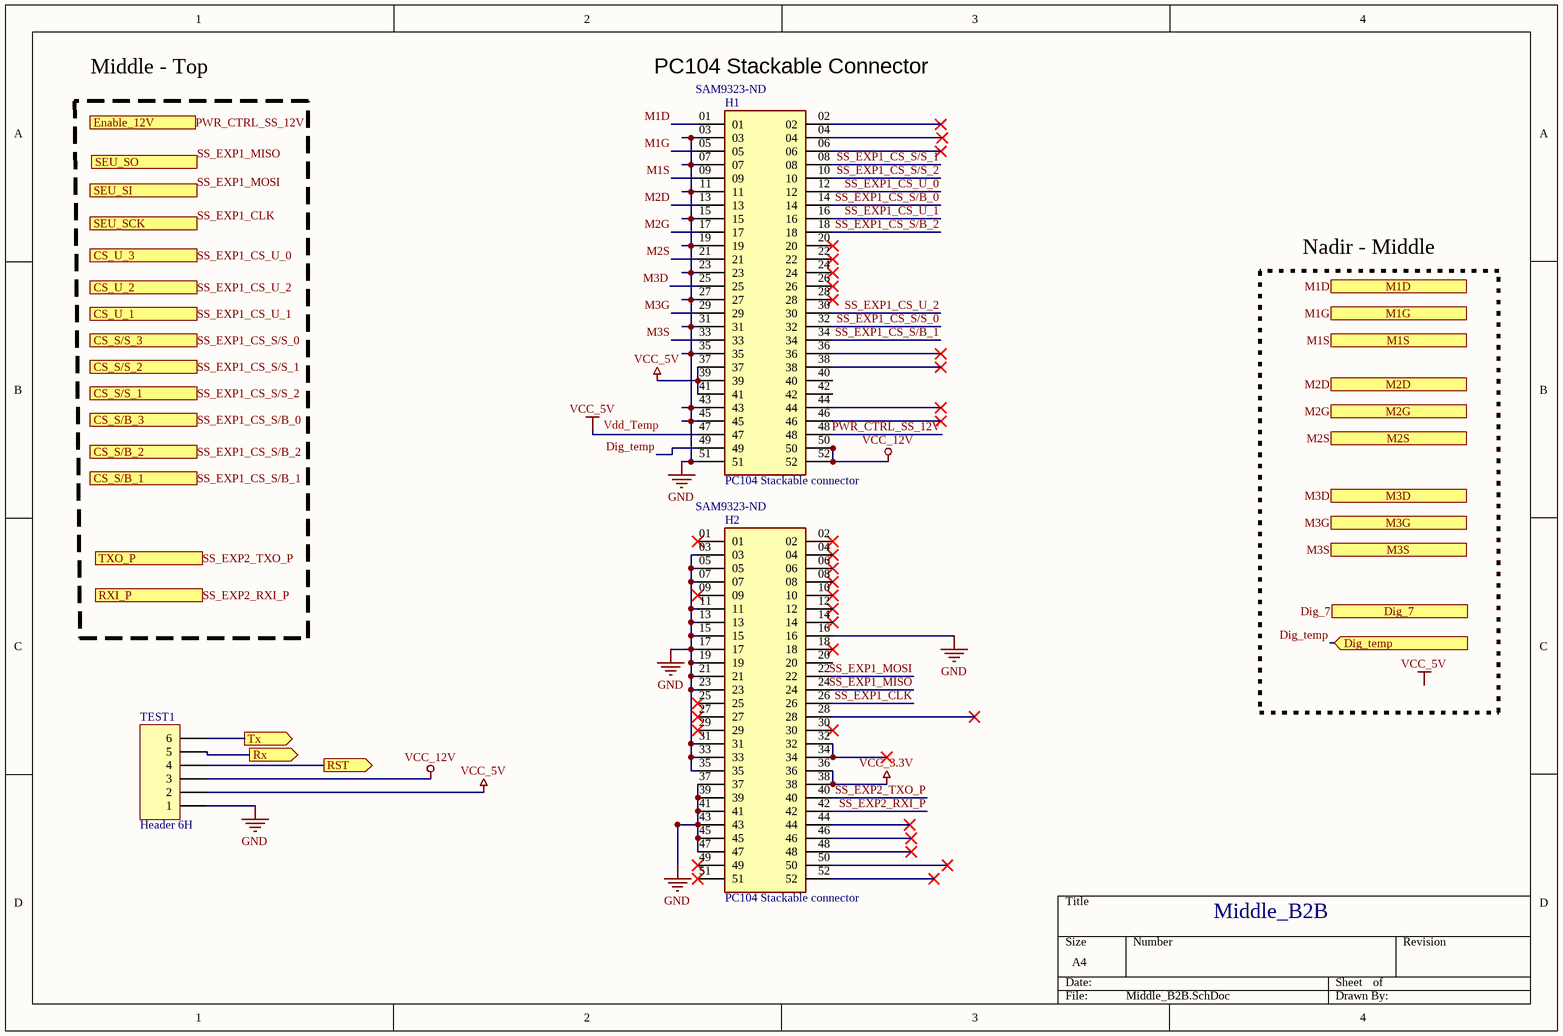
[diagram p4: Middle_B2B.SchDoc]

### Parts
H1  PC104 Stackable connector  Supplier Part Number 1: SAM9323-ND  [SAMTEC_ESQ-126-39-G-D]
H2  PC104 Stackable connector  Supplier Part Number 1: SAM9323-ND  [SAMTEC_ESQ-126-39-G-D]
TEST1  Header 6H  [HDR1X6H]

### Ports
CS_S/B_1 (out), CS_S/B_2 (out), CS_S/B_3 (out), CS_S/S_1 (out), CS_S/S_2 (out), CS_S/S_3 (out), CS_U_1 (out), CS_U_2 (out), CS_U_3 (out), Dig_7 (in), Dig_temp (in), Enable_12V (out), M1D (in), M1G (in), M1S (in), M2D (in), M2G (in), M2S (in), M3D (in), M3G (in), M3S (in), RST (out), Rx (out), RXI_P (out), SEU_SCK (out), SEU_SI (out), SEU_SO (in), Tx (out), TXO_P (in)

### Nets
GND: H1.03 H1.07 H1.11 H1.15 H1.19 H1.23 H1.27 H1.31 H1.35 H1.43 H1.45 H1.51 H2.03 H2.05 H2.07 H2.11 H2.13 H2.15 H2.16 H2.17 H2.19 H2.21 H2.23 H2.31 H2.33 H2.35 H2.37 H2.39 H2.41 H2.43 H2.45 H2.47 TEST1.1
VCC_3.3V: H2.36 H2.38
VCC_5V: H1.37 H1.39 H1.41 H1.47 TEST1.2
VCC_12V: H1.50 H1.52 TEST1.3
Dig_7: port Dig_7
Dig_temp: H1.49 ; port Dig_temp
M1D: H1.01 ; port M1D
M1G: H1.05 ; port M1G
M1S: H1.09 ; port M1S
M2D: H1.13 ; port M2D
M2G: H1.17 ; port M2G
M2S: H1.21 ; port M2S
M3D: H1.25 ; port M3D
M3G: H1.29 ; port M3G
M3S: H1.33 ; port M3S
PWR_CTRL_SS_12V: H1.48 ; port Enable_12V
RST: TEST1.4 ; port RST
Rx: TEST1.5 ; port Rx
SS_EXP1_CLK: H2.26 ; port SEU_SCK
SS_EXP1_CS_S/B_0: H1.14 ; port CS_S/B_3
SS_EXP1_CS_S/B_1: H1.34 ; port CS_S/B_1
SS_EXP1_CS_S/B_2: H1.18 ; port CS_S/B_2
SS_EXP1_CS_S/S_0: H1.32 ; port CS_S/S_3
SS_EXP1_CS_S/S_1: H1.08 ; port CS_S/S_2
SS_EXP1_CS_S/S_2: H1.10 ; port CS_S/S_1
SS_EXP1_CS_U_0: H1.12 ; port CS_U_3
SS_EXP1_CS_U_1: H1.16 ; port CS_U_1
SS_EXP1_CS_U_2: H1.30 ; port CS_U_2
SS_EXP1_MISO: H2.24 ; port SEU_SO
SS_EXP1_MOSI: H2.22 ; port SEU_SI
SS_EXP2_RXI_P: H2.42 ; port RXI_P
SS_EXP2_TXO_P: H2.40 ; port TXO_P
Tx: TEST1.6 ; port Tx
NetH2_32: H2.32 H2.34

Not connected (* = marked no-connect by the designer): H1 02* 04* 06* 20* 22* 24* 26* 28* 36* 38* 40 42 44* 46*; H2 01* 02* 04* 06* 08* 09* 10* 12* 14* 18* 20 25* 27* 28* 29* 30* 44* 46* 48* 49* 50* 51* 52*

### Notes on the sheet
- Middle - Top
- (near H1) PC104 Stackable Connector
- Nadir - Middle
- Vdd_Temp
- Middle_B2B
- Labels drawn without touching a wire or pin: VCC_5V

### Library data of the parts
H1 H2 = SAMTEC_ESQ-126-39-G-D: Header_2x26_2.54mm; Supplier 1: Digi-Key
TEST1 = Header 6H: Header, 6-Pin, Right Angle; LatestRevisionDate: 17-Jul-2002; LatestRevisionNote: Re-released for DXP Platform.; Publisher: Altium Limited

## Nets that join several sheets
GND: Middle_TID (31 pins), Middle_TID_B (31 pins), Middle_Arduino (5 pins), Middle_B2B (33 pins)
VCC_5V: Middle_TID_B (21 pins), Middle_Arduino (6 pins), Middle_B2B (5 pins)
VCC_12V: Middle_TID (C9.2 KEY_1.6 KEY_1.13), Middle_TID_B (C30.2 KEY_DAC1.13), Middle_B2B (H1.50 H1.52 TEST1.3)
Dig_1: Middle_TID (KEY_1.1 R1.2), Middle_Arduino (Arduino_Protected1.17)
Dig_2: Middle_TID (KEY_1.16 R2.2), Middle_Arduino (Arduino_Protected1.18)
Dig_3: Middle_TID (KEY_1.9 R3.2), Middle_Arduino (Arduino_Protected1.19)
Dig_4: Middle_TID_B (KEY_DAC1.1 R32.2), Middle_Arduino (Arduino_Protected1.21)
Dig_5: Middle_TID_B (KEY_DAC1.16 R33.2), Middle_Arduino (Arduino_Protected1.20)
Dig_6: Middle_TID_B (KEY_DAC1.9 R34.2), Middle_Arduino (Arduino_Protected1.22)
Dig_temp: Middle_Arduino (Arduino_Protected1.12 Rs9.2), Middle_B2B (H1.49)
FROM DAC_1: Middle_TID (Sensor1.3), Middle_TID_B (KEY_DAC1.2)
FROM DAC_2: Middle_TID (Sensor2.3), Middle_TID_B (KEY_DAC1.15)
FROM DAC_3: Middle_TID (Sensor3.3), Middle_TID_B (KEY_DAC1.10)
M1D: Middle_TID (Rd1.1), Middle_B2B (H1.01)
M1G: Middle_TID (Buffer_1.3 Rg1.2 Sensor1.6), Middle_B2B (H1.05)
M1S: Middle_TID (Buffer_1.5 Rs1.2 Sensor1.2), Middle_B2B (H1.09)
M2D: Middle_TID (Rd2.1), Middle_B2B (H1.13)
M2G: Middle_TID (Buffer_2.3 Rg2.2 Sensor2.6), Middle_B2B (H1.17)
M2S: Middle_TID (Buffer_2.5 Rs2.2 Sensor2.2), Middle_B2B (H1.21)
M3D: Middle_TID (Rd3.1), Middle_B2B (H1.25)
M3G: Middle_TID (Buffer_3.3 Rg3.2 Sensor3.6), Middle_B2B (H1.29)
M3S: Middle_TID (Buffer_3.5 Rs3.2 Sensor3.2), Middle_B2B (H1.33)
PWR_CTRL_SS_12V: Middle_TID (KEY_1.8 R4.2), Middle_B2B (H1.48)
RST: Middle_Arduino (Arduino_Protected1.15), Middle_B2B (TEST1.4)
Rx: Middle_Arduino (Arduino_Protected1.14 Q1.3 Rs6.1), Middle_B2B (TEST1.5)
SCL (AP): Middle_TID_B (7 pins), Middle_Arduino (Arduino_Protected1.32)
SDA (AP): Middle_TID_B (7 pins), Middle_Arduino (Arduino_Protected1.31)
SS_EXP2_RXI_P: Middle_Arduino (Rs10.1), Middle_B2B (H2.42)
SS_EXP2_TXO_P: Middle_Arduino (Rs4.2 Rs5.1), Middle_B2B (H2.40)
Tx: Middle_Arduino (Arduino_Protected1.13 Rs5.2), Middle_B2B (TEST1.6)
VG1: Middle_TID (Buffer_1.1 Buffer_1.2), Middle_TID_B (RF1.2)
VG2: Middle_TID (Buffer_2.1 Buffer_2.2), Middle_TID_B (RF3.2)
VG3: Middle_TID (Buffer_3.1 Buffer_3.2), Middle_TID_B (RF5.2)
VS1: Middle_TID (Buffer_1.6 Buffer_1.7), Middle_TID_B (RF2.2)
VS2: Middle_TID (Buffer_2.6 Buffer_2.7), Middle_TID_B (RF4.2)
VS3: Middle_TID (Buffer_3.6 Buffer_3.7), Middle_TID_B (RF6.2)

## Assembly variants
Variant of PCB_Middle: all parts fitted
OPERACIONAL: all parts fitted